# Altium schematic sheet SRAM.SchDoc: Animated Archer Main PCB
size Letter; Author: John Eric Martin; Engineer: John Eric Martin; Organization: UCCS IEEE Robotics; Address1: 1420 Austin Bluffs Pkwy; Address2: Colorado Springs, CO 80918; DocumentNumber: SRAM; Revision: 1; SheetNumber: 8; SheetTotal: 8; ProjectName: Animated Archer Quadcopter
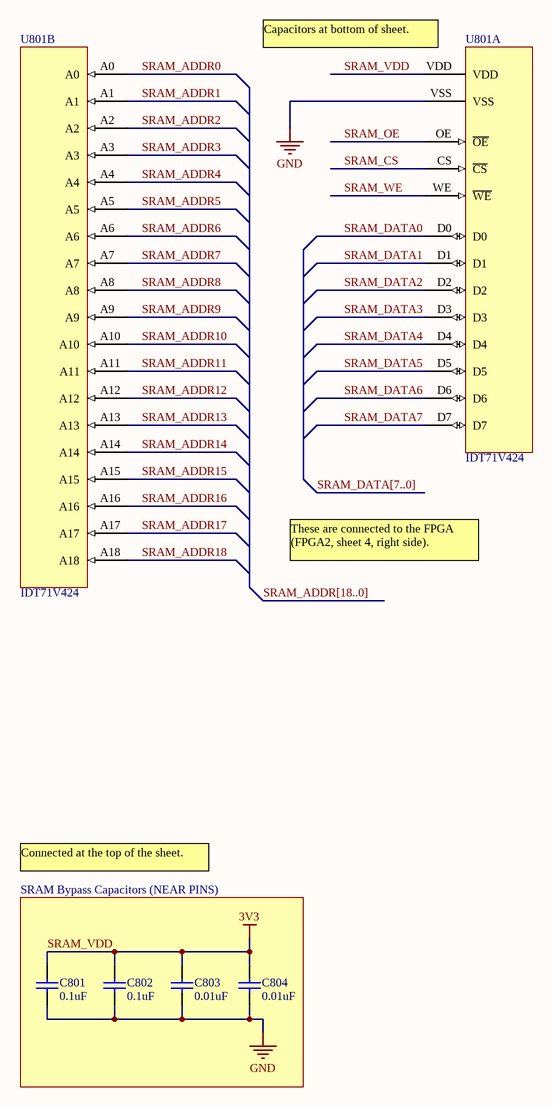
[diagram p0: SRAM.SchDoc]

## Parts
C801  0.1uF  [1608[0603]]
C802  0.1uF  [1608[0603]]
C803  value 0.01uF  [1608[0603]]  (hidden comment: 0.1uF)
C804  value 0.01uF  [1608[0603]]  (hidden comment: 0.1uF)
U801  IDT71V424  [IDT-TSOP-44]  (parts A,B of 2)

## Blocks framed on the sheet
SRAM Bypass Capacitors (NEAR PINS): C801-C804

## Nets
GND: C801.1 C802.1 C803.1 C804.1 U801.VSS
SRAM_VDD: C801.2 C802.2 C803.2 C804.2 U801.VDD  [also labelled 3V3]
SRAM_ADDR0: U801.A0
SRAM_ADDR1: U801.A1
SRAM_ADDR2: U801.A2
SRAM_ADDR3: U801.A3
SRAM_ADDR4: U801.A4
SRAM_ADDR5: U801.A5
SRAM_ADDR6: U801.A6
SRAM_ADDR7: U801.A7
SRAM_ADDR8: U801.A8
SRAM_ADDR9: U801.A9
SRAM_ADDR10: U801.A10
SRAM_ADDR11: U801.A11
SRAM_ADDR12: U801.A12
SRAM_ADDR13: U801.A13
SRAM_ADDR14: U801.A14
SRAM_ADDR15: U801.A15
SRAM_ADDR16: U801.A16
SRAM_ADDR17: U801.A17
SRAM_ADDR18: U801.A18
SRAM_CS: U801.CS(~{CS})
SRAM_DATA0: U801.D0
SRAM_DATA1: U801.D1
SRAM_DATA2: U801.D2
SRAM_DATA3: U801.D3
SRAM_DATA4: U801.D4
SRAM_DATA5: U801.D5
SRAM_DATA6: U801.D6
SRAM_DATA7: U801.D7
SRAM_OE: U801.OE(~{OE})
SRAM_WE: U801.WE(~{WE})

## Buses and harness runs
bus SRAM_ADDR[18..0]
bus SRAM_DATA[7..0]

## Notes on the sheet
- (near U801) Capacitors at bottom of sheet.
- These are connected to the FPGA (FPGA2, sheet 4, right side).
- Connected at the top of the sheet.
- Title
- Size:
- Date:
- Letter
- Number:
- Time:
- Revision:
- Sheet
- of
- File:

## Library data of the parts
C801-C804 = Cap Semi: Capacitor (Semiconductor SIM Model); Published: 8-Jun-2000; LatestRevisionDate: 29-May-2009; LatestRevisionNote: IPC-7351 Footprint Added.; PackageReference: C1206; Publisher: Altium Limited; PackageDescription: Chip Capacitor
  C801 C802: Value: 0.1uF
U801 = IDT71V424: IDT 3.3V CMOS Static RAM 4 Meg (512K x 8-Bit)